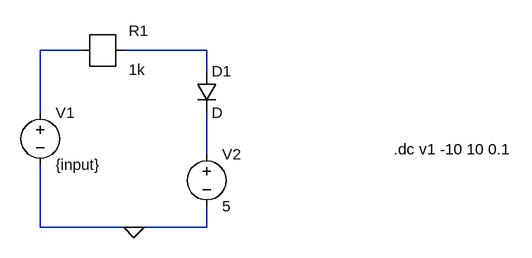
[diagram p0: schematic circuit_b_lt.asc]
circuit_b_lt.asc, the LTspice schematic file:
Version 4
SHEET 1 880 680
WIRE 16 176 -48 176
WIRE 208 176 80 176
WIRE 208 208 208 176
WIRE -48 272 -48 176
WIRE 208 336 208 272
WIRE -48 448 -48 352
WIRE 96 448 -48 448
WIRE 208 448 208 416
WIRE 208 448 96 448
FLAG 96 448 0
SYMBOL voltage -48 256 R0
SYMATTR InstName V1
SYMATTR Value {input}
SYMBOL voltage 208 320 R0
SYMATTR InstName V2
SYMATTR Value 5
SYMBOL r 16 176 R0
SYMATTR InstName R1
SYMATTR Value 1k
SYMBOL diode 192 208 R0
SYMATTR InstName D1
TEXT 496 328 Left 2 !.dc v1 -10 10 0.1

The netlist it stands for:
* circuit_b_lt.asc
V1 N001 0 {input}
V2 N003 0 5
R1 N002 N001 1k
D1 N002 N003 D
.model D D
.lib standard.dio
.dc v1 -10 10 0.1
.backanno
.end